# Altium schematic sheet phase_reference.SchDoc
size A
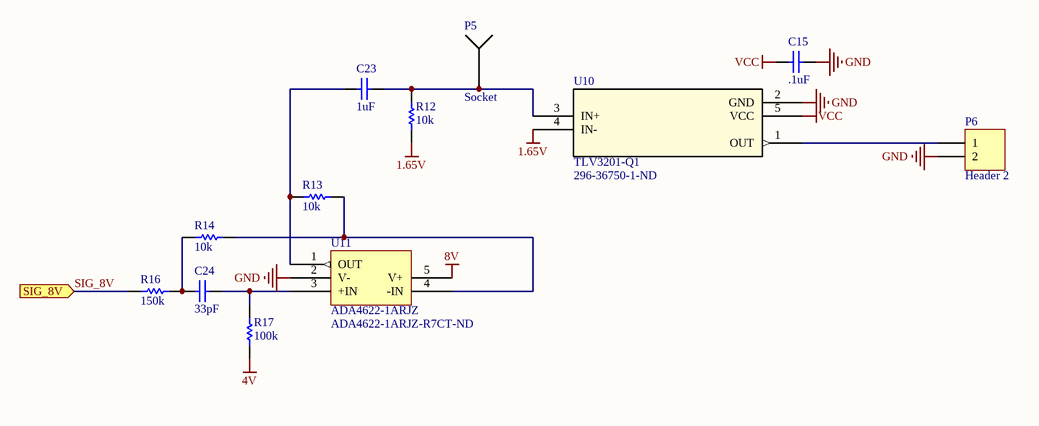
[diagram p0: phase_reference.SchDoc]

## Parts
C15  value .1uF  [0603]  (hidden comment: Cap)
C23  value 1uF  [0603]  (hidden comment: Cap)
C24  value 33pF  [0603]  (hidden comment: Cap)
P5  Socket  [socket]
P6  Header 2  [HDR1X2]
R12  value 10k  [0603]  (hidden comment: Res)
R13  value 10k  [0603]  (hidden comment: Res)
R14  value 10k  [0603]  (hidden comment: Res)
R16  value 150k  [0603]  (hidden comment: Res)
R17  value 100k  [0603]  (hidden comment: Res)
U10  TLV3201-Q1  Supplier Part Number 1: 296-36750-1-ND  [SOT95P280X145-5N]
U11  ADA4622-1ARJZ  Supplier Part Number 1: ADA4622-1ARJZ-R7CT-ND  [SOT95P280X145-5N]

## Ports
SIG_8V (in)

## Nets
1.65V: R12.1 U10.4(IN-)
4V: R17.1
8V: U11.5(V+)
GND: C15.2 P6.2 U10.2(GND) U11.2(V-)
VCC: C15.1 U10.5(VCC)
SIG_8V: R16.2 ; port SIG_8V
NetC23_1: C23.1 P5.0 R12.2 U10.3(IN+)
NetC23_2: C23.2 R13.2 U11.1(OUT)
NetC24_1: C24.1 R17.2 U11.3(+IN)
NetC24_2: C24.2 R14.2 R16.1
NetP6_1: P6.1 U10.1(OUT)
NetR13_1: R13.1 R14.1 U11.4(-IN)

## Library data of the parts
C15 C23 C24 = Cap: Ceramic Capacitor (Surface Mount); Manufacturer: Generic Ceramic Chip Cap (TBD); Digi-Key Part Number: *; Manufacturer Part Number: *; Note: *; Rating: *
P6 = Header 2: Header, 2-Pin; LatestRevisionDate: 17-Jul-2002; LatestRevisionNote: Re-released for DXP Platform.; Publisher: Altium Limited
R12-R14 R16 R17 = Res: Chip Resistor (Surface Mount); Manufacturer: Generic Chip Res (TBD); Manufacturer Part Number: *; Digi-Key Part Number: *; Rating: *
U10 = TLV3201-Q1: 40-ns, Micropower Comparator; Supplier 1: Digi-Key
U11 = ADA4622-1ARJZ: 30 V, 8 MHz, Low Bias Current, / Single-Supply, RRO, Precision Op Amps; ComponentLink1Description: Datasheet; ComponentLink1URL: http://www.analog.com/media/en/technical-documentation/data-sheets/ada4622-1-4622-2-4622-4.pdf; Supplier 1: Digi-Key